# Altium schematic sheet Zasilanie.SchDoc
size A4; SheetNumber: 2; SheetTotal: 3
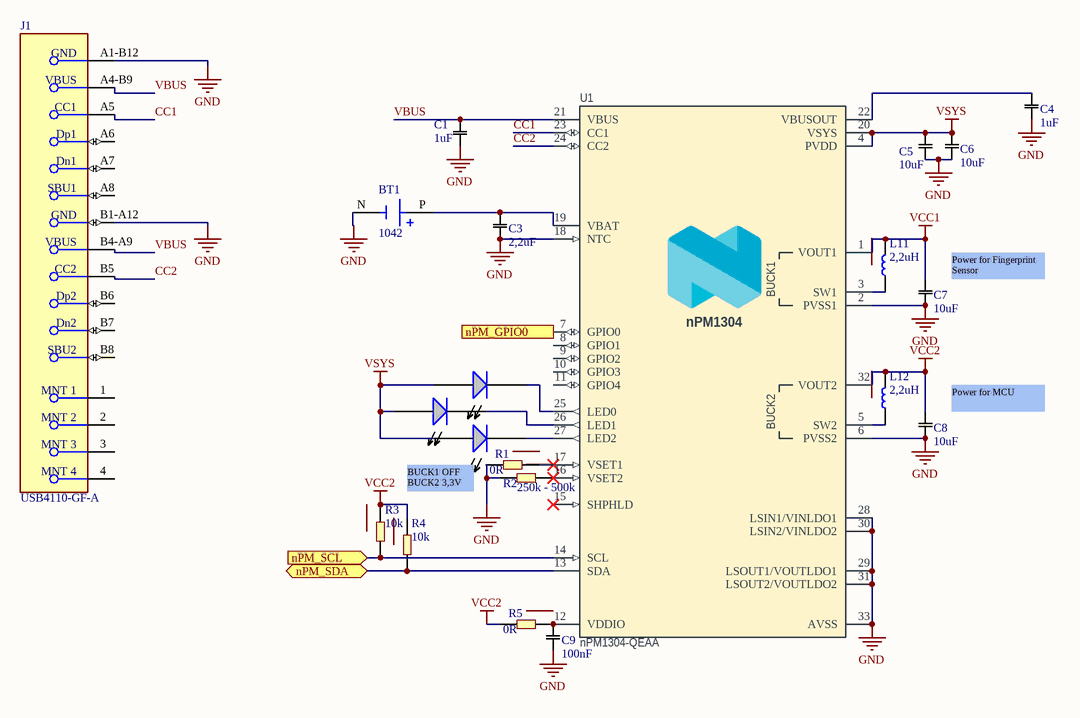
[diagram p0: Zasilanie.SchDoc]

## Parts
BT1  1042  [BAT_1042]
C1  1uF  [0402C]
C3  2,2uF  [0402C]
C4  1uF  [0402C]
C5  10uF  [0402C]
C6  10uF  [0402C]
C7  10uF  [0402C]
C8  10uF  [0402C]
C9  100nF  [0402C]
D1  LED  [0603LED_RED]  (value not drawn)
D2  LED  [0603LED_RED]  (value not drawn)
D3  LED  [0603LED_RED]  (value not drawn)
J1  USB4110-GF-A  [FP-USB4110-GF-A-MFG]
L11  2,2uH  [0402L]
L12  2,2uH  [0402L]
R1  0R  [0402R]
R2  250k - 500k  [0402R]
R3  10k  [0402R]
R4  10k  [0402R]
R5  0R  [0402R]
U1  nPM1304-QEAA  [Nordic_QFN50P500X500X90-33N]

## Ports
nPM_GPIO0 (in, see Schemat_blokowy[3B]), nPM_SCL (in, see Schemat_blokowy[3B]), nPM_SDA (bidir, see Schemat_blokowy[3B])

## Nets
GND: BT1.N(NEG) C1.1 C3.1 C4.2 C5.2 C6.2 C7.2 C8.2 C9.1 J1.A1-B12(GND) J1.B1-A12(GND) R1.1 R2.1 U1.2(PVSS1) U1.6(PVSS2) U1.18(NTC) U1.28(LSIN1/VINLDO1) U1.29(LSOUT1/VOUTLDO1) U1.30(LSIN2/VINLDO2) U1.31(LSOUT2/VOUTLDO2) U1.33(AVSS)
VCC1: C7.1 L11.2 U1.1(VOUT1)
VCC2: C8.1 L12.2 R3.2 R4.2 R5.1 U1.32(VOUT2)
VSYS: C5.1 C6.1 D1.2 D2.2 D3.2 U1.4(PVDD) U1.20(VSYS)
CC1: J1.A5(CC1) U1.23(CC1)
CC2: J1.B5(CC2) U1.24(CC2)
nPM_GPIO0: U1.7(GPIO0) ; port nPM_GPIO0
nPM_SCL: R3.1 U1.14(SCL) ; port nPM_SCL
nPM_SDA: R4.1 U1.13(SDA) ; port nPM_SDA
VBUS: C1.2 J1.A4-B9(VBUS) J1.B4-A9(VBUS) U1.21(VBUS)
NetBT1_P: BT1.P(POS) C3.2 U1.19(VBAT)
NetC4_1: C4.1 U1.22(VBUSOUT)
NetC9_2: C9.2 R5.2 U1.12(VDDIO)
NetD1_1: D1.1 U1.25(LED0)
NetD2_1: D2.1 U1.26(LED1)
NetD3_1: D3.1 U1.27(LED2)
NetL11_1: L11.1 U1.3(SW1)
NetL12_1: L12.1 U1.5(SW2)
NetR1_2: R1.2 U1.17(VSET1)
NetR2_2: R2.2 U1.16(VSET2)

Not connected (* = marked no-connect by the designer): J1 1(MNT_1) 2(MNT_2) 3(MNT_3) 4(MNT_4) A6(Dp1) A7(Dn1) A8(SBU1) B6(Dp2) B7(Dn2) B8(SBU2); U1 8(GPIO1) 9(GPIO2) 10(GPIO3) 11(GPIO4) 15(SHPHLD)*

## Notes on the sheet
- (near C7) Power for Fingerprint Sensor
- (near C8) Power for MCU
- BUCK1 OFF
  BUCK2 3,3V
- (in symbol nPM1304_QEAA) BUCK1; nPM1304; BUCK2

## Library data of the parts
BT1 = 1042: SMT Holder for 18650 Battery; MF: Keystone Electronics Corp.; SnapEDA_Link: https://www.snapeda.com/parts/1042/Keystone/view-part/?ref=snap; Package: NON STANDARD-5 Keystone; Value: *; MP: 1042; Check_prices: https://www.snapeda.com/parts/1042/Keystone/view-part/?ref=eda
C1 C3-C9 = C: Capacitor
  C1 C4: Value: 1uF
  C3: Value: 2,2uF
  C5-C8: Value: 10uF
  C9: Value: 100nF
J1 = USB-C: USB-C Connector, CMP-245163-000002-1; Manufacturer: GCT; Conn Orientation: Right Angle; Usb Standard: USB 2.0; Voltage Rating: 20V; Current Rating: 3/4.25/1.25/0.25A; Number Of Contacts: 16; Is Female: yes; Shielding: true; Standoff Height: 0.1mm; Octopart: https://octopart.com/usb4110-gf-a-gct-103941985; Temperature: -40°C to +85°C; RoHS: TRUE; Automotive: No; Contact Material: Gold,Nickel; Device Class L1: Connectors; Device Class L2: USB Connectors; Package: 0; Lead Free: Yes; ComponentLink2URL: https://gct.co/files/drawings/usb4110.pdf; Temperature Range High: +85°C; Temperature Range Low: -40°C; Height: 3.46mm; Manufacturer Part Number: USB4110-GF-A; ComponentLink2Description: Datasheet; Device Class L3: unset; Digikey Description: CONN USB 2.0 TYPE-C R/A SMT; Category: Conn
L11 L12 = L: Inductor; Value: 2,2uH
R1-R5 = R: Resistor
  R1 R5: Value: 0R
  R2: Value: 250k - 500k
  R3 R4: Value: 10k
U1 = nPM1304_QEAA: Li-Ion/Li-Polymer USB-C battery charger with high efficiency buck regulators, LDOs or load switches, LED drivers, TWI and VBUSOUT; Manufacturer: Nordic Semiconductor; Part number NEMS: 102000396; Component Status: Active; Pad Count: 33; Artikkelnr Noca: N.A.; Part Number: nPM1304-QEAA; Component Class: Nordic_Devices; Author: eisk; Manufacturer Part Number: nPM1304-QEAA; ComponentLink1URL: N.A.; ComponentLink1Description: Datasheet; ComponentLink2URL: N.A.; ComponentLink2Description: Supplier link; HelpURL: N.A.; LatestRevisionDate: 2025-03-07; Published: 2025-03-07; Footprint Doc: QFN-32; Value: nPM1304-QEAA; Supplier 1: Nordic Semiconductor; Supplier Part Number 1: nPM1304-QEAA; Supplier 2: N.A.; Supplier Part Number 2: N.A.; Part number IPS: N.A.; Part number Norautron: N.A.; PartId: 102000396